# Altium project UPS.PrjPcb (part 2 of 3)

## Sheet Power.SchDoc: Power.SchDoc
size A4; Author: Daniel Sinko; Revision: A; SheetNumber: 3; SheetTotal: 5
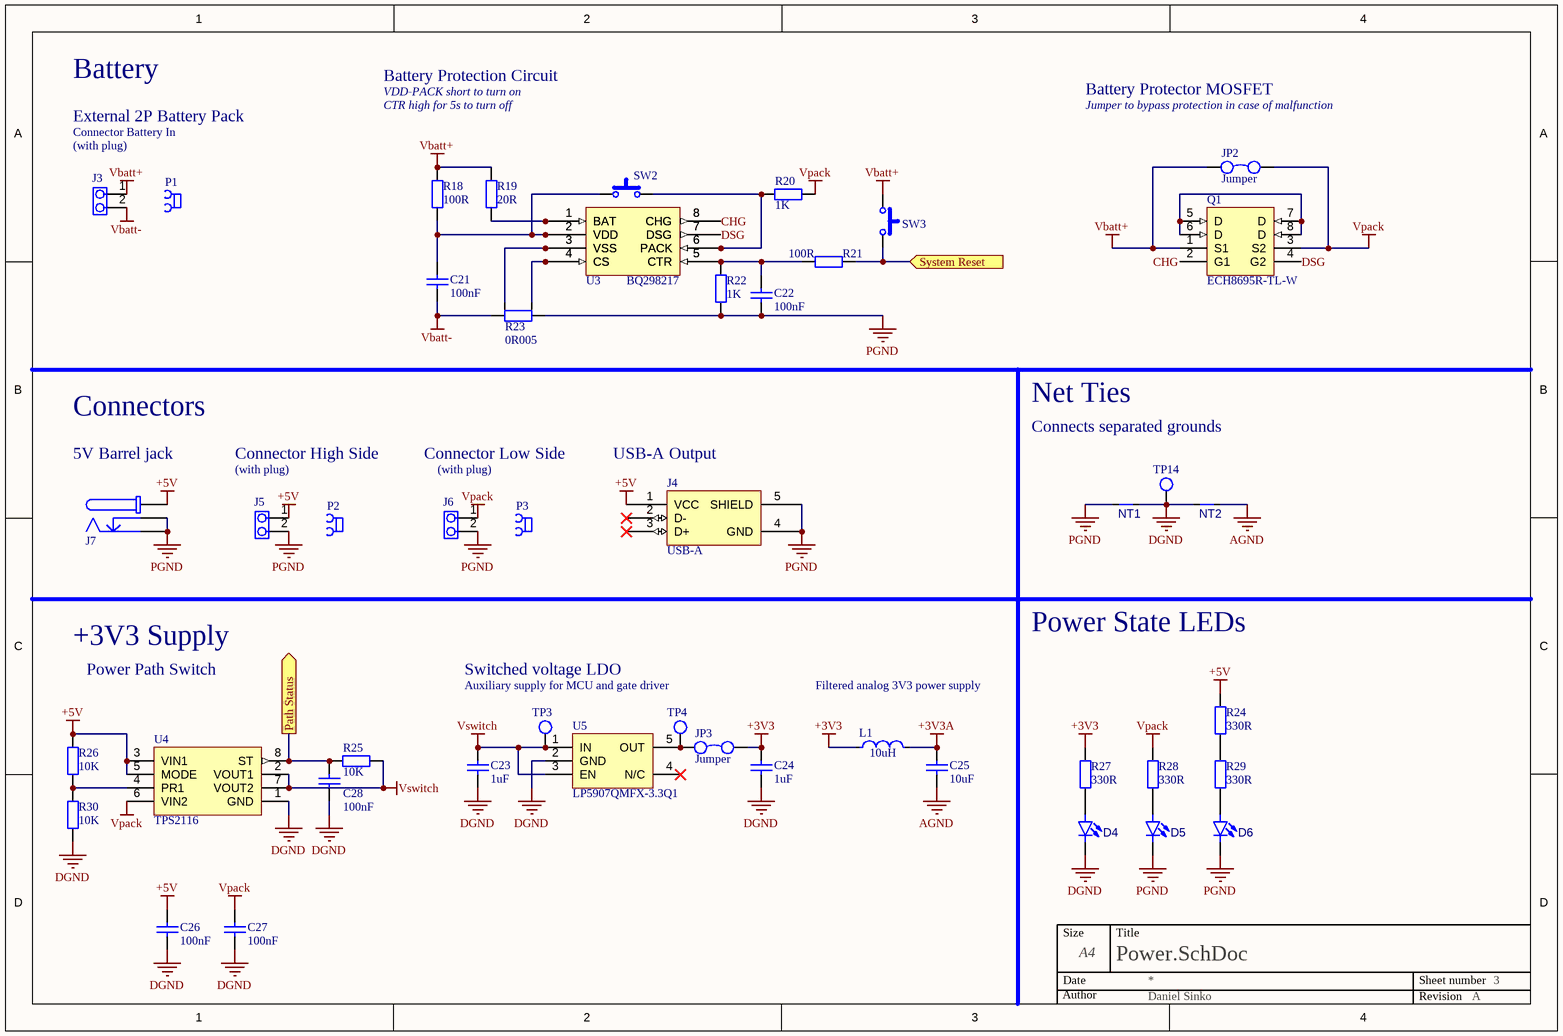
[diagram p3: Power.SchDoc]

### Parts
C21  100nF  [CAP0603]
C22  100nF  [CAP0603]
C23  1uF  [CAP0603]
C24  1uF  [CAP0603]
C25  10uF  [CAP0603]
C26  100nF  [CAP0603]
C27  100nF  [CAP0603]
C28  100nF  [CAP0603]
D4  (no value)  [LED0603]
D5  (no value)  [LED0603]
D6  (no value)  [LED0603]
J3  691313510002  [WR-TBL-5.08/2-M]  (value not drawn)
J4  USB-A  [USB-A-FEMALE]
J5  691313510002  [WR-TBL-5.08/2-M]  (value not drawn)
J6  691313510002  [WR-TBL-5.08/2-M]  (value not drawn)
J7  DC Power Jack  [DC Power Jack Right Angled]  (value not drawn)
JP2  Jumper  [PIN-1X2]
JP3  Jumper  [PIN-1X2]
L1  value 10uH  [IND0603]  (hidden comment: Inductor)
NT1  NetTie_1-1  [NETTIE_1.85MM]  (value not drawn)  (net tie, no BOM)
NT2  NetTie_1-1  [NETTIE_1.85MM]  (value not drawn)  (net tie, no BOM)
P1  691351500002  [WR-TBL-5.08/2-F]  (value not drawn)  (mechanical)
P2  691351500002  [WR-TBL-5.08/2-F]  (value not drawn)  (mechanical)
P3  691351500002  [WR-TBL-5.08/2-F]  (value not drawn)  (mechanical)
Q1  ECH8695R-TL-W  [SOT-28FL]
R18  100R  [RES0603]
R19  20R  [RES0603]
R20  1K  [RES0603]
R21  100R  [RES0603]
R22  1K  [RES0603]
R23  0R005  [RES1206_KELVIN]
R24  330R  [RES0603]
R25  10K  [RES0603]
R26  10K  [RES0603]
R27  330R  [RES0603]
R28  330R  [RES0603]
R29  330R  [RES0603]
R30  10K  [RES0603]
SW2  PTS526 Button  [PTS526 SMG15J SMTR2 LFS]  (value not drawn)
SW3  PTS526 Button  [PTS526 SMG15J SMTR2 LFS]  (value not drawn)
TP3  Test Point  [TP-1.5HOLE]  (value not drawn)
TP4  Test Point  [TP-1.5HOLE]  (value not drawn)
TP14  Test Point  [TP-1.5HOLE]  (value not drawn)
U3  BQ298217  [X2QFN-8]
U4  TPS2116  [SOTFL50P160X60-8N]
U5  LP5907QMFX-3.3Q1  [SOT23-5]

### Ports
Path Status (out, see Main[3C], uC[3B]), System Reset (in, see Main[3C], uC[3B])

### Nets
+3V3: C24.2 JP3.2 L1.1 R27.2
+3V3A: C25.2 L1.2
+5V: C26.2 J4.1(VCC) J5.1 J7.1 R24.2 R26.2 U4.3(VIN1) U4.5(MODE)
AGND: C25.1 NT2.2
DGND: C23.1 C24.1 C26.1 C27.1 C28.1 D4.1(K) NT1.2 NT2.1 R30.1 TP14.1 U4.1(GND) U5.2(GND)
PGND: C22.1 D5.1(K) D6.1(K) J4.4(GND) J4.5(SHIELD) J5.2 J6.2 J7.2 J7.3 NT1.1 R22.1 R23.2
Vbatt+: J3.1 JP2.1 Q1.1(S1) R18.2 R19.2 SW3.1
Vbatt-: C21.1 J3.2 R23.1
Vpack: C27.2 J6.1 JP2.2 Q1.3(S2) R20.2 R28.2 U4.6(VIN2)
Vswitch: C23.2 R25.1 TP3.1 U4.2(VOUT1) U4.7(VOUT2) U5.1(IN) U5.3(EN)
CHG: Q1.2(G1) U3.8(CHG)
DSG: Q1.4(G2) U3.7(DSG)
Path Status: C28.2 R25.2 U4.8(ST) ; port Path Status
System Reset: R21.2 SW3.2 ; port System Reset
NetC21_2: C21.2 R18.1 SW2.1 U3.2(VDD)
NetC22_2: C22.2 R21.1 R22.2 U3.5(CTR)
NetD4_2: D4.2(A) R27.1
NetD5_2: D5.2(A) R28.1
NetD6_2: D6.2(A) R29.1
NetJP3_1: JP3.1 TP4.1 U5.5(OUT)
NetQ1_5: Q1.5(D) Q1.6(D) Q1.7(D) Q1.8(D)
NetR19_1: R19.1 U3.1(BAT)
NetR20_1: R20.1 SW2.2 U3.6(PACK)
NetR23_3: R23.3 U3.3(VSS)
NetR23_4: R23.4 U3.4(CS)
NetR24_1: R24.1 R29.2
NetR26_1: R26.1 R30.2 U4.4(PR1)

Not connected (* = marked no-connect by the designer): J4 2(D-)* 3(D+)*; U5 4(N/C)*

### Notes on the sheet
- Battery
- Battery Protection Circuit
- VDD-PACK short to turn on
- CTR high for 5s to turn off
- Battery Protector MOSFET
- Jumper to bypass protection in case of malfunction
- External 2P Battery Pack
- Connector Battery In
- (with plug)
- Connectors
- Net Ties
- Connects separated grounds
- (near J7) 5V Barrel jack
- Connector High Side
- Connector Low Side
- (near J4) USB-A Output
- +3V3 Supply
- Power State LEDs
- Power Path Switch
- Switched voltage LDO
- Auxiliary supply for MCU and gate driver
- Filtered analog 3V3 power supply
- Size
- Date
- A4
- Title
- Sheet number
- Author
- Revision

### Library data of the parts
C21 C22 C26-C28 = 100nF: Ceramic Capacitor, Multilayer, Ceramic, 25V, 10% +Tol, 10% -Tol, X7R, 15% TC, 0.1uF, Surface Mount, 0603; Manufacturer: Samsung; Manufacturer Part Number: CL10B104KA8WPNC; Multilayer: Yes; Reference Standard: AEC-Q200; Voltage: *; Value: 100nF; Supplier: Mouser; Supplier Part Number: 187-CL10B104KA8WPNC; RoHS: Yes; Category: Ceramic Capacitors; Stock: 62899; Pricing: 1=0.1, 10=0.026, 50=0.026, 100=0.018, 1000=0.014, 10000=0.009 (USD); Mounting Technology: Surface Mount; Pins: 2; Dielectric Material: Ceramic; Package Shape: Rectangular; Case/Package: 0603; Terminal Finish: Nickel; Min Operating Temperature: -55°C; Max Operating Temperature: 125°C; JESD-609 Code: e3; Capacitor Type: Ceramic; Tolerance  (fill in as +-): 10%; Packaging: Tape and Reel; Tolerance (fill in as +-): 10%; Rated DC Voltage (URdc): 25V; Temperature Characteristics Code: X7R; Termination: Wraparound; Reach SVHC Compliant: Yes; RoHS Compliant: Yes; ComponentLink1URL: https://datasheet.ciiva.com:443/pdfs/VipMasterIC/IC/SEMS/SEMS-S-A0005596039/SEMS-S-A0005592818-1.pdf?src-supplier=IHS+Markit; ComponentLink1Description: https://datasheet.ciiva.com:443/pdfs/VipMasterIC/IC/SEMS/SEMS-S-A0005596039/SEMS-S-A0005592818-1.pdf?src-supplier=IHS+Markit; ComponentLink2URL: http://www.samsungsem.com/kr/support/library/product-catalog/mlcc.jsp?src-supplier=Digikey; ComponentLink2Description: http://www.samsungsem.com/kr/support/library/product-catalog/mlcc.jsp?src-supplier=Digikey; ComponentLink3URL: http://www.samsungsem.com/kr/support/product-search/mlcc/CL10B104KA8WPNC.jsp?src-supplier=Digikey; ComponentLink3Description: http://www.samsungsem.com/kr/support/product-search/mlcc/CL10B104KA8WPNC.jsp?src-supplier=Digikey; ComponentLink4URL: http://www.samsungsem.com/servlet/FileDownload?filename=productcatalog/pdf/MLCC.pdf&src-supplier=Avnet; ComponentLink4Description: http://www.samsungsem.com/servlet/FileDownload?filename=productcatalog/pdf/MLCC.pdf&src-supplier=Avnet; ComponentLink5URL: https://datasheet.octopart.com/CL10B104KA8WPNC-Samsung-Electro-Mechanics-datasheet-148763375.pdf?src-supplier=Future+Electronics; ComponentLink5Description: https://datasheet.octopart.com/CL10B104KA8WPNC-Samsung-Electro-Mechanics-datasheet-148763375.pdf?src-supplier=Future+Electronics; ComponentLink6URL: https://datasheet.octopart.com/CL10B104KA8WPNC-Samsung-datasheet-8326407.pdf?src-supplier=TME; ComponentLink6Description: https://datasheet.octopart.com/CL10B104KA8WPNC-Samsung-datasheet-8326407.pdf?src-supplier=TME
C23 C24 = 1uF: Ceramic Capacitor, Multilayer, Ceramic, 16V, 10% +Tol, 10% -Tol, X7R, 15% TC, 1uF, Surface Mount, 0603; Manufacturer: Walsin Technologies; Manufacturer Part Number: SH18B105K160CT; Voltage: *; Value: 1uF; Supplier: Mouser; Supplier Part Number: 791-SH18B105K160CT; RoHS: Yes; Category: Ceramic Capacitors; Stock: 5174; Pricing: 1=0.1, 10=0.04, 50=0.04, 100=0.023, 1000=0.015, 10000=0.01 (USD); ComponentLink1URL: https://datasheet.octopart.com/SH18B105K160CT-Walsin-Technologies-datasheet-149178370.pdf?src-supplier=TECHDesign; ComponentLink1Description: https://datasheet.octopart.com/SH18B105K160CT-Walsin-Technologies-datasheet-149178370.pdf?src-supplier=TECHDesign
C25 = 10uF: Ceramic Capacitor, Multilayer, Ceramic, 6.3V, 20% +Tol, 20% -Tol, X5R, 15% TC, 10uF, Surface Mount, 0603; Manufacturer: Samsung; Manufacturer Part Number: CL10A106MQ8NNND; Multilayer: Yes; Voltage: *; Supplier: Mouser; Supplier Part Number: 187-CL10A106MQ8NNND; RoHS: Yes; Category: Ceramic Capacitors; Stock: 103768; Pricing: 1=0.1, 10=0.066, 50=0.066, 100=0.031, 1000=0.019, 10000=0.014 (USD); Mounting Technology: Surface Mount; Pins: 2; Dielectric Material: Ceramic; Package Shape: Rectangular; Case/Package: 0603; Terminal Finish: Nickel; Min Operating Temperature: -55°C; Max Operating Temperature: 85°C; JESD-609 Code: e3; Capacitor Type: Ceramic; Tolerance  (fill in as +-): 20%; Package Style: SMTMeter; Packaging: Tape and Reel; Tolerance (fill in as +-): 20%; Rated DC Voltage (URdc): 6.3V; Temperature Characteristics Code: X5R; Termination: Wraparound; Length: 1.6mm; Width: 0.8mm; Height: 0.8mm; Reach SVHC Compliant: Yes; RoHS Compliant: Yes; ComponentLink1URL: https://datasheet.ciiva.com:443/pdfs/VipMasterIC/IC/SEMS/SEMS-S-A0008522793/SEMS-S-A0008522909-1.pdf?src-supplier=IHS+Markit; ComponentLink1Description: https://datasheet.ciiva.com:443/pdfs/VipMasterIC/IC/SEMS/SEMS-S-A0008522793/SEMS-S-A0008522909-1.pdf?src-supplier=IHS+Markit; Value: 10uF
D4-D6 = LED Green: Single Color LED, Bright Green, Water Clear, 1.1mm; Manufacturer: Wurth Electronics; Manufacturer Part Number: 150060VS75000; Shape: Rectangular; Forward Current: 30mA; Luminous Intensity-Nom: 40mcd; Channels: 1; Viewing Angle: 140°; Overall Height: 0.7mm; Supplier: Mouser; Supplier Part Number: 710-150060VS75000; RoHS: Yes; Category: LEDs; Stock: 96633; Pricing: 1=0.15, 10=0.15, 50=0.142, 100=0.122, 1000=0.116, 10000=0.116 (USD); Mounting Technology: Surface Mount; Pins: 2; Color: Green; Min Operating Temperature: -40°C; Max Operating Temperature: 85°C; Lens Style: WATER CLEAR; Optoelectronic Device Type: SINGLE COLOR LED; Packaging: Tape and Reel; Size: 1.1mm; Terminal Pitch: 1.6mm; Reach SVHC Compliant: Yes; RoHS Compliant: Yes; ComponentLink1URL: https://datasheet.ciiva.com:443/pdfs/VipMasterIC/IC/MIDC/MIDC-S-A0007768636/MIDC-S-A0007768636-1.pdf?src-supplier=IHS+Markit; ComponentLink1Description: https://datasheet.ciiva.com:443/pdfs/VipMasterIC/IC/MIDC/MIDC-S-A0007768636/MIDC-S-A0007768636-1.pdf?src-supplier=IHS+Markit; ComponentLink2URL: https://datasheet.ciiva.com/29562/150060vs75000-29562919.pdf?src-supplier=Digikey; ComponentLink2Description: https://datasheet.ciiva.com/29562/150060vs75000-29562919.pdf?src-supplier=Digikey
J3 J5 J6 = 691313510002: Wurth Elektronik, 2 Pin Pluggable Terminal Block, Male; Manufacturer: Wurth Electronics; Manufacturer Series: 313; Fastening Method: CONNECTOR; Number of Decks: 1; Number of Ways: 2; Current Rating: 20A; Voltage Rating: 300V; Safety Approval: UL,VDE; Datasheet Link: https://www.we-online.de/katalog/datasheet/6913135100xx.pdf; Height: 8.5mm; Manufacturer_Name: Wurth Elektronik; Manufacturer_Part_Number: 691313510002; Mouser Part Number: 710-691313510002; Mouser Price/Stock: https://www.mouser.co.uk/ProductDetail/Wurth-Elektronik/691313510002?qs=2kOmHSv6VfR6BrMDgUh3kQ%3D%3D; Supplier: Mouser; Supplier Part Number: 710-691313510002; Manufacturer Part Number: 691313510002; RoHS: Yes; Category: Terminal Blocks; Stock: 1885; Pricing: 1=0.35, 10=0.315, 50=0.295, 100=0.295, 1000=0.295, 10000=0.294 (USD); Mounting Technology: Board; Number of Rows: 1; Terminal and Terminal Block Type: STRIP TERMINAL BLOCK; Reach SVHC Compliant: Yes; RoHS Compliant: Yes; ComponentLink1URL: https://datasheet.ciiva.com:443/pdfs/VipMasterIC/IC/MIDC/MIDC-S-A0008053020/MIDC-S-A0008053020-1.pdf?src-supplier=IHS+Markit; ComponentLink1Description: https://datasheet.ciiva.com:443/pdfs/VipMasterIC/IC/MIDC/MIDC-S-A0008053020/MIDC-S-A0008053020-1.pdf?src-supplier=IHS+Markit; ComponentLink2URL: https://datasheet.ciiva.com/8043/1442232-8043521.pdf?src-supplier=Element14; ComponentLink2Description: https://datasheet.ciiva.com/8043/1442232-8043521.pdf?src-supplier=Element14; ComponentLink3URL: https://datasheet.ciiva.com/795/6913135100xx-795821.pdf?src-supplier=Digikey; ComponentLink3Description: https://datasheet.ciiva.com/795/6913135100xx-795821.pdf?src-supplier=Digikey
J4 = USB-A: USB Connector; Manufacturer: Bel; Manufacturer Part Number: SS-52100-001; Supplier: Mouser; Supplier Part Number: 530-SS-52100-001; RoHS: Yes; Category: Connectors; Stock: 6440; Pricing: 1=0.57, 10=0.346, 50=0.346, 100=0.286, 1000=0.252, 10000=0.252 (USD); RoHS Compliant: Yes; ComponentLink1URL: https://datasheet.ciiva.com:443/pdfs/VipMasterIC/IC/BELF/BELF-S-A0007110717/BELF-S-A0007110717-1.pdf?src-supplier=IHS+Markit; ComponentLink1Description: https://datasheet.ciiva.com:443/pdfs/VipMasterIC/IC/BELF/BELF-S-A0007110717/BELF-S-A0007110717-1.pdf?src-supplier=IHS+Markit; ComponentLink2URL: http://www.farnell.com/datasheets/2813579.pdf?src-supplier=Farnell; ComponentLink2Description: http://www.farnell.com/datasheets/2813579.pdf?src-supplier=Farnell; ComponentLink3URL: https://belfuse.com/resources/drawings/stewartconnector/dr-stw-ss-52100-001.pdf?src-supplier=Digikey; ComponentLink3Description: https://belfuse.com/resources/drawings/stewartconnector/dr-stw-ss-52100-001.pdf?src-supplier=Digikey; ComponentLink4URL: http://www.farnell.com/datasheets/2813579.pdf?src-supplier=Newark; ComponentLink4Description: http://www.farnell.com/datasheets/2813579.pdf?src-supplier=Newark; ComponentLink5URL: https://datasheet.octopart.com/SS-52100-001-Bel-Fuse-datasheet-137355466.pdf?src-supplier=Sager+Electronics; ComponentLink5Description: https://datasheet.octopart.com/SS-52100-001-Bel-Fuse-datasheet-137355466.pdf?src-supplier=Sager+Electronics
J7 = DC Power Jack: CIRCULAR DC POWER CONNECTOR; Manufacturer: Wurth Electronics; Manufacturer Part Number: 694106301002; Connector Type: Circular,Power; Supplier: Mouser; Supplier Part Number: 710-694106301002; RoHS: Yes; Category: Power Connectors; Stock: 9038; Contact Finish - Mating: NOT SPECIFIED; Reach SVHC Compliant: Yes; RoHS Compliant: Yes; ComponentLink1URL: https://datasheet.ciiva.com:443/pdfs/VipMasterIC/IC/MIDC/MIDC-S-A0001192814/MIDC-S-A0001192814-1.pdf?src-supplier=IHS+Markit; ComponentLink1Description: https://datasheet.ciiva.com:443/pdfs/VipMasterIC/IC/MIDC/MIDC-S-A0001192814/MIDC-S-A0001192814-1.pdf?src-supplier=IHS+Markit; ComponentLink2URL: http://www.mouser.com/ds/2/445/6941xx301002-469315.pdf?src-supplier=Mouser; ComponentLink2Description: http://www.mouser.com/ds/2/445/6941xx301002-469315.pdf?src-supplier=Mouser; ComponentLink3URL: http://www.farnell.com/cad/2130967.pdf?src-supplier=Element14; ComponentLink3Description: http://www.farnell.com/cad/2130967.pdf?src-supplier=Element14; ComponentLink4URL: https://katalog.we-online.de/em/datasheet/6941xx301002.pdf?src-supplier=Digikey; ComponentLink4Description: https://katalog.we-online.de/em/datasheet/6941xx301002.pdf?src-supplier=Digikey; Pricing: 1=1.02, 10=0.97, 50=0.86, 100=0.8, 1000=0.59, 10000=0.59 (USD)
JP2 JP3 = Jumper: Interconnection Device; Manufacturer: Harwin; Manufacturer Part Number: M7582-46; Manufacturer Series: M75; Additional Feature: ROHS COMPLIANT; Body/Shell Style: PLUG; Contact Pattern: RECTANGULAR; Contact Resistance: 20mR; Contact Style: SQ PIN-SKT; Dielectric Withstanding Voltage (AC): 500V; Insertion Force-Max: 6.672N; Insulation Resistance: 5GR; Number Of Connectors: 1; Rated Current (Signal): 1A; Number of Contacts: 2; Body Breadth: 0.094inch; Body Depth: 0.236inch; Body Length: 0.197inch; Mating Contact Pitch: 0.1inch; Reference Standard: UL; Reliability: COMMERCIAL; Supplier: Mouser; Supplier Part Number: 855-M7582-46; RoHS: Yes; Category: Uncategorized; Stock: 4991; Pricing: 1=0.19, 10=0.125, 50=0.125, 100=0.104, 1000=0.075, 10000=0.072 (USD); Contact Material: Bronze; Contact Finish - Mating: SN; Contact Finish - Termination: Tin (Sn); Insulation Color: Black; Insulation Material: Glass; Min Operating Temperature: -55°C; Max Operating Temperature: 105°C; Connector Type: Interconnection Device; JESD-609 Code: e3; Contact Gender: Female; Mounting Style: STRAIGHT; Number of Rows Loaded: 1; Reach SVHC Compliant: Yes; RoHS Compliant: Yes; ComponentLink1URL: https://datasheet.ciiva.com:443/pdfs/VipMasterIC/IC/HRWN/HRWNS06295/HRWNS06295-1.pdf?src-supplier=IHS+Markit; ComponentLink1Description: https://datasheet.ciiva.com:443/pdfs/VipMasterIC/IC/HRWN/HRWNS06295/HRWNS06295-1.pdf?src-supplier=IHS+Markit; ComponentLink2URL: http://www.mouser.com/ds/2/181/M7580-M7583-351524.pdf?src-supplier=Mouser; ComponentLink2Description: http://www.mouser.com/ds/2/181/M7580-M7583-351524.pdf?src-supplier=Mouser; ComponentLink3URL: https://cdn.harwin.com/pdfs/Harwin_PC_Connectors_M20.pdf?src-supplier=Digikey; ComponentLink3Description: https://cdn.harwin.com/pdfs/Harwin_PC_Connectors_M20.pdf?src-supplier=Digikey; ComponentLink4URL: http://www.harwin.com/include/downloads/pdfs/2010PAGE125.PDF?src-supplier=Avnet; ComponentLink4Description: http://www.harwin.com/include/downloads/pdfs/2010PAGE125.PDF?src-supplier=Avnet
L1 = 10uH: General Purpose Inductor, 10uH, 20%, 1 Element, Ferrite-Core, SMD, 1608M; Manufacturer: TDK; Manufacturer Part Number: MLZ1608E100MT; Manufacturer Series: MLZ; Case/Size Code: 1608-M; DC Resistance (DCR): 900mR; Inductor Application: POWER INDUCTOR; Channels: 1; Max Current Rating: 250mA; Self Resonant Frequency: 50MHz; Shape/Size Description: RECTANGULAR PACKAGE; Shielding: Shielded; Test Frequency: 2MHz; Package Height: 0.8mm; Package Length: 1.6mm; Supplier: Mouser; Supplier Part Number: 810-MLZ1608E100MT; RoHS: Yes; Category: Fixed Inductors; Stock: 135059; Pricing: 1=0.1, 10=0.092, 50=0.092, 100=0.065, 1000=0.045, 10000=0.038 (USD); Pins: 2; Min Operating Temperature: -55°C; Max Operating Temperature: 125°C; Tolerance: 20%; Inductance-Nom (L): 10uH; Inductor Type: GENERAL PURPOSE INDUCTOR; Surface Mount: Yes; Terminal Placement: Dual Ended; Termination: Wraparound; Reach SVHC Compliant: Yes; RoHS Compliant: Yes; ComponentLink1URL: https://datasheet.ciiva.com:443/pdfs/VipMasterIC/IC/TDKC/TDKCS08829/TDKCS08829-1.pdf?src-supplier=IHS+Markit; ComponentLink1Description: https://datasheet.ciiva.com:443/pdfs/VipMasterIC/IC/TDKC/TDKCS08829/TDKCS08829-1.pdf?src-supplier=IHS+Markit; Core Material: Ferrite; Construction: Magnetic Shielded; Package Style: SMTMeter; Packaging: Tape and Reel; Series: MLZ1608; Package Width: 0.8mm; ComponentLink2URL: https://datasheet.ciiva.com/11802/0900766b8082f86a-11802168.pdf?src-supplier=Rs; ComponentLink2Description: https://datasheet.ciiva.com/11802/0900766b8082f86a-11802168.pdf?src-supplier=Rs; ComponentLink3URL: https://datasheet.ciiva.com/4963/inductor-commercial-decoupling-mlz-en-310280-4963660.pdf?src-supplier=Mouser; ComponentLink3Description: https://datasheet.ciiva.com/4963/inductor-commercial-decoupling-mlz-en-310280-4963660.pdf?src-supplier=Mouser
NT1 NT2 = NetTie_1-1: NetTie 1 -> 1; ID: 22; Value: NetTie 1-1 0.2mm; Inventory_Category: Other; Part Class: NetTie; Technology: SMT
P1-P3 = 691351500002: Wurth Elektronik, 2 Pin Pluggable Terminal Block, Female; Manufacturer: Wurth Electronics; Manufacturer Series: 3515; ComponentLink1URL: https://datasheet.ciiva.com:443/pdfs/VipMasterIC/IC/MIDC/MIDC-S-A0008053020/MIDC-S-A0008053020-1.pdf?src-supplier=IHS+Markit; ComponentLink1Description: https://datasheet.ciiva.com:443/pdfs/VipMasterIC/IC/MIDC/MIDC-S-A0008053020/MIDC-S-A0008053020-1.pdf?src-supplier=IHS+Markit; ComponentLink2URL: https://datasheet.ciiva.com/8043/1442232-8043521.pdf?src-supplier=Element14; ComponentLink2Description: https://datasheet.ciiva.com/8043/1442232-8043521.pdf?src-supplier=Element14; ComponentLink3URL: https://datasheet.ciiva.com/795/6913135100xx-795821.pdf?src-supplier=Digikey; ComponentLink3Description: https://datasheet.ciiva.com/795/6913135100xx-795821.pdf?src-supplier=Digikey; Supplier: Mouser; Supplier Part Number: 710-691351500002; Manufacturer Part Number: 691351500002; RoHS: Yes; Category: Terminal Blocks; Stock: 2108; Pricing: 1=1.03, 10=0.919, 50=0.87, 100=0.87, 1000=0.87, 10000=0.87 (USD); Terminal and Terminal Block Type: BARRIER STRIP TERMINAL BLOCK; Reach SVHC Compliant: No; RoHS Compliant: Yes; ComponentLink4URL: https://datasheet.ciiva.com:443/pdfs/VipMasterIC/IC/MIDC/MIDCS16685/MIDCS16685-1.pdf?src-supplier=IHS+Markit; ComponentLink4Description: https://datasheet.ciiva.com:443/pdfs/VipMasterIC/IC/MIDC/MIDCS16685/MIDCS16685-1.pdf?src-supplier=IHS+Markit; ComponentLink5URL: https://datasheet.ciiva.com/7992/624595-7992355.pdf?src-supplier=Element14; ComponentLink5Description: https://datasheet.ciiva.com/7992/624595-7992355.pdf?src-supplier=Element14; ComponentLink6URL: https://datasheet.ciiva.com/796/6913515000xx-796118.pdf?src-supplier=Digikey; ComponentLink6Description: https://datasheet.ciiva.com/796/6913515000xx-796118.pdf?src-supplier=Digikey; ComponentLink7URL: https://datasheet.ciiva.com/48686/001088727-da-01-en-wr-tbl-terminal-block351-691351500002-48686810.pdf?src-supplier=Conrad; ComponentLink7Description: https://datasheet.ciiva.com/48686/001088727-da-01-en-wr-tbl-terminal-block351-691351500002-48686810.pdf?src-supplier=Conrad
Q1 = ECH8695R-TL-W: Power Field-Effect Transistor, 11A I(D), N-Channel, Metal-oxide Semiconductor FET; Manufacturer_Name: onsemi; Manufacturer: ON Semiconductor; Power Dissipation-Max (Abs): 1.5W; Datasheet Link: https://datasheet.datasheetarchive.com/originals/distributors/DKDS-17/338047.pdf; Height: 0.95mm; Manufacturer_Part_Number: ECH8695R-TL-W; Mouser Part Number: 863-ECH8695R-TL-W; Mouser Price/Stock: https://www.mouser.co.uk/ProductDetail/ON-Semiconductor/ECH8695R-TL-W?qs=dbuNSGnowt2koJiK%2FkW5Eg%3D%3D; Arrow Part Number: ECH8695R-TL-W; Arrow Price/Stock: https://www.arrow.com/en/products/ech8695r-tl-w/on-semiconductor?region=europe; Supplier: Mouser; Supplier Part Number: 863-ECH8695R-TL-W; Manufacturer Part Number: ECH8695R-TL-W; RoHS: Yes; Category: MOSFETs; Stock: 28139; Pricing: 1=0.62, 10=0.473, 50=0.473, 100=0.364, 1000=0.295, 10000=0.246 (USD); Terminal Finish: Tin; Max Operating Temperature: 150°C; JESD-609 Code: e6; Polarity/Channel Type: N-CHANNEL; Drain Current-Max (Abs) (ID): 11A; FET Technology: METAL-OXIDE SEMICONDUCTOR; Moisture Sensitivity Level: 1; Surface Mount: Yes; RoHS Compliant: Yes; Reach SVHC Compliant: No; ComponentLink1URL: https://datasheet.ciiva.com:443/pdfs/VipMasterIC/IC/ONSM/ONSM-S-A0002809098/ONSM-S-A0002809098-1.pdf?src-supplier=IHS+Markit; ComponentLink1Description: https://datasheet.ciiva.com:443/pdfs/VipMasterIC/IC/ONSM/ONSM-S-A0002809098/ONSM-S-A0002809098-1.pdf?src-supplier=IHS+Markit; ComponentLink2URL: http://www.mouser.com/ds/2/308/ENA2314-D-466764.pdf?src-supplier=Mouser; ComponentLink2Description: http://www.mouser.com/ds/2/308/ENA2314-D-466764.pdf?src-supplier=Mouser; ComponentLink3URL: http://uk.rs-online.com/webdocs/1366/0900766b81366e5e.pdf?src-supplier=Rs; ComponentLink3Description: http://uk.rs-online.com/webdocs/1366/0900766b81366e5e.pdf?src-supplier=Rs; ComponentLink4URL: http://www.alliedelec.com/m/d/7426d35da80661b4f4a350039c44cd95.pdf?src-supplier=Allied+Electronics; ComponentLink4Description: http://www.alliedelec.com/m/d/7426d35da80661b4f4a350039c44cd95.pdf?src-supplier=Allied+Electronics; ComponentLink5URL: http://www.onsemi.com/pub/Collateral/ECH8695R-D.PDF?src-supplier=Digikey; ComponentLink5Description: http://www.onsemi.com/pub/Collateral/ECH8695R-D.PDF?src-supplier=Digikey; ComponentLink6URL: http://www.onsemi.com/pub/Collateral/ENA2314-D.PDF?src-supplier=Avnet; ComponentLink6Description: http://www.onsemi.com/pub/Collateral/ENA2314-D.PDF?src-supplier=Avnet
R18 R21 = 100R: Fixed Resistor, Metal Glaze/thick Film, 0.1W, 100ohm, 75V, 5% +/-Tol, 100ppm/Cel, Surface Mount, 0603; Manufacturer: Yageo; Manufacturer Part Number: RC0603JR-13100RL; Additional Feature: LASER TRIMMABLE; Rated Temperature: 70°C; Temperature Coefficient: 100ppm/°C; Package Height: 0.45mm; Package Length: 1.6mm; Package Width: 0.8mm; Value: 100R; Supplier Part Number: 603-RC0603JR-13100RL; RoHS: Yes; Category: Chip SMD Resistors; Stock: 92782; Pricing: 1=0.1, 10=0.01, 50=0.01, 100=0.006, 1000=0.005, 10000=0.003 (USD); Mounting Technology: Surface Mount; Pins: 2; Package Shape: Rectangular; Case/Package: 0603; Terminal Finish: Nickel; Min Operating Temperature: -55°C; Max Operating Temperature: 155°C; JESD-609 Code: e3; Resistor Type: FIXED RESISTOR; Construction: Chip; Packaging: Tape and Reel; Technology: METAL GLAZE/THICK FILM; Termination: Wraparound; Working Voltage: 75V; Reach SVHC Compliant: Yes; RoHS Compliant: Yes; ComponentLink1URL: https://datasheet.ciiva.com:443/pdfs/VipMasterIC/IC/YAGO/YAGO-S-A0008145938/YAGO-S-A0008145938-1.pdf?src-supplier=IHS+Markit; ComponentLink1Description: https://datasheet.ciiva.com:443/pdfs/VipMasterIC/IC/YAGO/YAGO-S-A0008145938/YAGO-S-A0008145938-1.pdf?src-supplier=IHS+Markit; ComponentLink2URL: https://datasheet.ciiva.com/12558/rc0603-272842-12558903.pdf?src-supplier=Mouser; ComponentLink2Description: https://datasheet.ciiva.com/12558/rc0603-272842-12558903.pdf?src-supplier=Mouser; ComponentLink3URL: https://datasheet.ciiva.com/7983/443971-7983750.pdf?src-supplier=Element14; ComponentLink3Description: https://datasheet.ciiva.com/7983/443971-7983750.pdf?src-supplier=Element14
R19 = 20R: Fixed Resistor, Metal Glaze/thick Film, 0.1W, 20ohm, 75V, 1% +/-Tol, 100ppm/Cel, Surface Mount, 0603; Manufacturer: Vishay; Manufacturer Part Number: CRCW060320R0FKEA; Temperature Coefficient: 100ppm/°C; Rated Temperature: 70°C; Package Height: 0.45mm; Package Length: 1.55mm; Package Width: 0.85mm; Reference Standard: AEC-Q200; Value: 20R; Supplier Part Number: 71-CRCW0603-20-E3; RoHS: Yes; Category: Chip SMD Resistors; Stock: 239322; Pricing: 1=0.1, 10=0.014, 50=0.014, 100=0.01, 1000=0.008, 10000=0.004 (USD); Mounting Technology: Surface Mount; Pins: 2; Case/Package: 0603; Terminal Finish: Nickel; Package Shape: Rectangular; Min Operating Temperature: -55°C; Max Operating Temperature: 155°C; JESD-609 Code: e3; Resistor Type: FIXED RESISTOR; Construction: Chip; Packaging: Tape and Reel; Technology: METAL GLAZE/THICK FILM; Working Voltage: 75V; Termination: Wraparound; Reach SVHC Compliant: Yes; RoHS Compliant: Yes; ComponentLink1URL: https://datasheet.ciiva.com:443/pdfs/VipMasterIC/IC/VISH/VISH-S-A0007266705/VISH-S-A0007266705-1.pdf?src-supplier=IHS+Markit; ComponentLink1Description: https://datasheet.ciiva.com:443/pdfs/VipMasterIC/IC/VISH/VISH-S-A0007266705/VISH-S-A0007266705-1.pdf?src-supplier=IHS+Markit; ComponentLink2URL: https://datasheet.ciiva.com/11810/0900766b80d98afc-11810778.pdf?src-supplier=Rs; ComponentLink2Description: https://datasheet.ciiva.com/11810/0900766b80d98afc-11810778.pdf?src-supplier=Rs; ComponentLink3URL: https://datasheet.ciiva.com/26316/fld-crcw-e3-data-en-26316589.pdf?src-supplier=Distrelec; ComponentLink3Description: https://datasheet.ciiva.com/26316/fld-crcw-e3-data-en-26316589.pdf?src-supplier=Distrelec; ComponentLink4URL: https://datasheet.ciiva.com/16776/70201119-16776202.pdf?src-supplier=Allied+Electronics; ComponentLink4Description: https://datasheet.ciiva.com/16776/70201119-16776202.pdf?src-supplier=Allied+Electronics; ComponentLink5URL: https://datasheet.ciiva.com/16788/70201119-16788011.pdf?src-supplier=Allied+Electronics; ComponentLink5Description: https://datasheet.ciiva.com/16788/70201119-16788011.pdf?src-supplier=Allied+Electronics; ComponentLink6URL: https://datasheet.ciiva.com/3257/dcrcwe3-3257244.pdf?src-supplier=Avnet; ComponentLink6Description: https://datasheet.ciiva.com/3257/dcrcwe3-3257244.pdf?src-supplier=Avnet; ComponentLink7URL: https://datasheet.ciiva.com/16374/dcrcwe3-16374634.pdf?src-supplier=Future+Electronics; ComponentLink7Description: https://datasheet.ciiva.com/16374/dcrcwe3-16374634.pdf?src-supplier=Future+Electronics; ComponentLink8URL: https://datasheet.ciiva.com/7748/1533075-7748858.pdf?src-supplier=Element14; ComponentLink8Description: https://datasheet.ciiva.com/7748/1533075-7748858.pdf?src-supplier=Element14; ComponentLink9URL: https://datasheet.ciiva.com/2465/dcrcwe3-2465673.pdf?src-supplier=Digikey; ComponentLink9Description: https://datasheet.ciiva.com/2465/dcrcwe3-2465673.pdf?src-supplier=Digikey; ComponentLink10URL: https://datasheet.ciiva.com/2465/dcrcwe3-2465674.pdf?src-supplier=Digikey; ComponentLink10Description: https://datasheet.ciiva.com/2465/dcrcwe3-2465674.pdf?src-supplier=Digikey; ComponentLink11URL: https://datasheet.ciiva.com/2465/dcrcwe3-2465672.pdf?src-supplier=Digikey; ComponentLink11Description: https://datasheet.ciiva.com/2465/dcrcwe3-2465672.pdf?src-supplier=Digikey; ComponentLink12URL: https://datasheet.ciiva.com/5548/dcrcwe3-109170-5548022.pdf?src-supplier=Mouser; ComponentLink12Description: https://datasheet.ciiva.com/5548/dcrcwe3-109170-5548022.pdf?src-supplier=Mouser; ComponentLink13URL: https://datasheet.ciiva.com/3257/dcrcwe3-3257243.pdf?src-supplier=Avnet; ComponentLink13Description: https://datasheet.ciiva.com/3257/dcrcwe3-3257243.pdf?src-supplier=Avnet
R20 R22 = 1K: Fixed Resistor, Metal Glaze/thick Film, 0.1W, 1000ohm, 75V, 1% +/-Tol, 100ppm/Cel, Surface Mount, 0603; Manufacturer: Bourns; Manufacturer Part Number: CR0603-FX-1001ELF; Rated Temperature: 70°C; Temperature Coefficient: 100ppm/°C; Working Voltage: 50V; Package Height: 0.45mm; Package Length: 1.6mm; Package Width: 0.8mm; Value: 1K; Supplier Part Number: 652-CR0603FX-1001ELF; RoHS: Yes; Category: Chip SMD Resistors; Stock: 320220; Pricing: 1=0.1, 10=0.009, 50=0.009, 100=0.005, 1000=0.004, 10000=0.002 (USD); Mounting Technology: Surface Mount; Pins: 2; Package Shape: Rectangular; Case/Package: 0603; Terminal Finish: Nickel; Min Operating Temperature: -55°C; Max Operating Temperature: 155°C; JESD-609 Code: e3; Termination: Wraparound; Resistor Type: FIXED RESISTOR; Construction: Chip; Packaging: Tape and Reel; Technology: RUTHENIUM OXIDE; Reach SVHC Compliant: Yes; RoHS Compliant: Yes; ComponentLink1URL: https://datasheet.ciiva.com:443/pdfs/VipMasterIC/IC/BOUR/BOUR-S-A0009069624/BOUR-S-A0009069624-1.pdf?src-supplier=IHS+Markit; ComponentLink1Description: https://datasheet.ciiva.com:443/pdfs/VipMasterIC/IC/BOUR/BOUR-S-A0009069624/BOUR-S-A0009069624-1.pdf?src-supplier=IHS+Markit; ComponentLink2URL: https://datasheet.ciiva.com/11808/0900766b80fcdb72-11808035.pdf?src-supplier=Rs; ComponentLink2Description: https://datasheet.ciiva.com/11808/0900766b80fcdb72-11808035.pdf?src-supplier=Rs; ComponentLink3URL: https://datasheet.ciiva.com/19466/774882-19466523.pdf?src-supplier=Jameco; ComponentLink3Description: https://datasheet.ciiva.com/19466/774882-19466523.pdf?src-supplier=Jameco; ComponentLink4URL: https://datasheet.ciiva.com/7001/1902866-7001622.pdf?src-supplier=Newark; ComponentLink4Description: https://datasheet.ciiva.com/7001/1902866-7001622.pdf?src-supplier=Newark; ComponentLink5URL: https://datasheet.ciiva.com/7986/691949-7986156.pdf?src-supplier=Element14; ComponentLink5Description: https://datasheet.ciiva.com/7986/691949-7986156.pdf?src-supplier=Element14; ComponentLink6URL: https://datasheet.ciiva.com/22693/1902866-22693205.pdf?src-supplier=Element14; ComponentLink6Description: https://datasheet.ciiva.com/22693/1902866-22693205.pdf?src-supplier=Element14; ComponentLink7URL: https://datasheet.ciiva.com/5546/chpreztr-5546283.pdf?src-supplier=Mouser; ComponentLink7Description: https://datasheet.ciiva.com/5546/chpreztr-5546283.pdf?src-supplier=Mouser; ComponentLink8URL: https://datasheet.ciiva.com/16757/70154685-16757482.pdf?src-supplier=Allied+Electronics; ComponentLink8Description: https://datasheet.ciiva.com/16757/70154685-16757482.pdf?src-supplier=Allied+Electronics; ComponentLink9URL: https://datasheet.ciiva.com/3255/chpreztr-3255917.pdf?src-supplier=Avnet; ComponentLink9Description: https://datasheet.ciiva.com/3255/chpreztr-3255917.pdf?src-supplier=Avnet; ComponentLink10URL: https://datasheet.ciiva.com/6547/chpreztr-6547350.pdf?src-supplier=Digikey; ComponentLink10Description: https://datasheet.ciiva.com/6547/chpreztr-6547350.pdf?src-supplier=Digikey; ComponentLink11URL: https://datasheet.ciiva.com/6547/chpreztr-6547351.pdf?src-supplier=Digikey; ComponentLink11Description: https://datasheet.ciiva.com/6547/chpreztr-6547351.pdf?src-supplier=Digikey; ComponentLink12URL: https://datasheet.ciiva.com/6547/chpreztr-6547349.pdf?src-supplier=Digikey; ComponentLink12Description: https://datasheet.ciiva.com/6547/chpreztr-6547349.pdf?src-supplier=Digikey; ComponentLink13URL: https://datasheet.ciiva.com/30115/159chpreztr-30115222.pdf?src-supplier=Onlinecomponents.com; ComponentLink13Description: https://datasheet.ciiva.com/30115/159chpreztr-30115222.pdf?src-supplier=Onlinecomponents.com
R23 = 0R005: Resistor Current Sense Metal Foil 1206 5m Ohm 1% 1W ±50ppm/°C T/R; Manufacturer: Eaton; Manufacturer Part Number: MFSA1206R0050FCM; Supplier Part Number: 504-MFSA1206R0050FCM; RoHS: No; Category: Chip SMD Resistors; Stock: 9199; Pricing: 1=0.21, 10=0.173, 50=0.173, 100=0.128, 1000=0.096, 10000=0.062 (USD); Temperature Coefficient: 50ppm/°C; Value: 0R005
R24 R27-R29 = 330R: Fixed Resistor, Metal Glaze/thick Film, 0.1W, 330ohm, 75V, 1% +/-Tol, 100ppm/Cel, Surface Mount, 0603; Manufacturer: Walsin Technologies; Manufacturer Part Number: WR06X3300FTL; Rated Temperature: 70°C; Temperature Coefficient: 100ppm/°C; Working Voltage: 50V; Package Height: 0.45mm; Package Length: 1.6mm; Package Width: 0.8mm; Value: 330R; Supplier Part Number: 791-WR06X3300FTL; RoHS: Yes; Category: Chip SMD Resistors; Stock: 10415; Pricing: 1=0.1, 10=0.007, 50=0.007, 100=0.003, 1000=0.003, 10000=0.001 (USD); Mounting Technology: Surface Mount; Pins: 2; Package Shape: Rectangular; Case/Package: 0603; Terminal Finish: Nickel; Min Operating Temperature: -55°C; Max Operating Temperature: 155°C; JESD-609 Code: e3; Resistor Type: FIXED RESISTOR; Packaging: Tape and Reel; Termination: Wraparound; Construction: Chip; Technology: METAL GLAZE/THICK FILM; Reach SVHC Compliant: Yes; RoHS Compliant: Yes; ComponentLink1URL: https://datasheet.ciiva.com:443/pdfs/VipMasterIC/IC/WATC/WATC-S-A0005256878/WATC-S-A0005256878-1.pdf?src-supplier=IHS+Markit; ComponentLink1Description: https://datasheet.ciiva.com:443/pdfs/VipMasterIC/IC/WATC/WATC-S-A0005256878/WATC-S-A0005256878-1.pdf?src-supplier=IHS+Markit; ComponentLink2URL: http://www.farnell.com/datasheets/1960319.pdf?src-supplier=Farnell; ComponentLink2Description: http://www.farnell.com/datasheets/1960319.pdf?src-supplier=Farnell; ComponentLink3URL: https://datasheet.octopart.com/WR06X3300FTL-Walsin-Technologies-datasheet-48038251.pdf?src-supplier=Element14; ComponentLink3Description: https://datasheet.octopart.com/WR06X3300FTL-Walsin-Technologies-datasheet-48038251.pdf?src-supplier=Element14; ComponentLink4URL: https://www.verical.com/server-webapp/html/getDatasheet?partID=414704&src-supplier=Verical; ComponentLink4Description: https://www.verical.com/server-webapp/html/getDatasheet?partID=414704&src-supplier=Verical
R25 R26 R30 = 10K: Fixed Resistor, Metal Glaze/thick Film, 0.1W, 10000ohm, 75V, 1% +/-Tol, 100ppm/Cel, Surface Mount, 0603; Manufacturer: Bourns; Manufacturer Part Number: CR0603-FX-1002ELF; Rated Temperature: 70°C; Temperature Coefficient: 100ppm/°C; Working Voltage: 50V; Package Height: 0.45mm; Package Length: 1.6mm; Package Width: 0.8mm; Value: 10K; Supplier Part Number: 652-CR0603FX-1002ELF; RoHS: Yes; Category: Chip SMD Resistors; Stock: 335503; Pricing: 1=0.1, 10=0.009, 50=0.009, 100=0.005, 1000=0.004, 10000=0.002 (USD); Mounting Technology: Surface Mount; Pins: 2; Package Shape: Rectangular; Case/Package: 0603; Terminal Finish: Nickel; Min Operating Temperature: -55°C; Max Operating Temperature: 155°C; Termination: Wraparound; JESD-609 Code: e3; Resistor Type: FIXED RESISTOR; Construction: Chip; Packaging: Tape and Reel; Technology: RUTHENIUM OXIDE; Reach SVHC Compliant: Yes; RoHS Compliant: Yes; ComponentLink1URL: https://datasheet.ciiva.com:443/pdfs/VipMasterIC/IC/BOUR/BOUR-S-A0009069624/BOUR-S-A0009069624-1.pdf?src-supplier=IHS+Markit; ComponentLink1Description: https://datasheet.ciiva.com:443/pdfs/VipMasterIC/IC/BOUR/BOUR-S-A0009069624/BOUR-S-A0009069624-1.pdf?src-supplier=IHS+Markit; ComponentLink2URL: https://datasheet.ciiva.com/11808/0900766b80fcdb72-11808032.pdf?src-supplier=Rs; ComponentLink2Description: https://datasheet.ciiva.com/11808/0900766b80fcdb72-11808032.pdf?src-supplier=Rs; ComponentLink3URL: https://datasheet.ciiva.com/27049/774903-27049975.pdf?src-supplier=Jameco; ComponentLink3Description: https://datasheet.ciiva.com/27049/774903-27049975.pdf?src-supplier=Jameco; ComponentLink4URL: https://datasheet.ciiva.com/22644/1849498-22644171.pdf?src-supplier=Element14; ComponentLink4Description: https://datasheet.ciiva.com/22644/1849498-22644171.pdf?src-supplier=Element14; ComponentLink5URL: https://datasheet.ciiva.com/22693/1902866-22693206.pdf?src-supplier=Element14; ComponentLink5Description: https://datasheet.ciiva.com/22693/1902866-22693206.pdf?src-supplier=Element14; ComponentLink6URL: https://datasheet.ciiva.com/5548/chpreztr-5548911.pdf?src-supplier=Mouser; ComponentLink6Description: https://datasheet.ciiva.com/5548/chpreztr-5548911.pdf?src-supplier=Mouser; ComponentLink7URL: https://datasheet.ciiva.com/16757/70154685-16757483.pdf?src-supplier=Allied+Electronics; ComponentLink7Description: https://datasheet.ciiva.com/16757/70154685-16757483.pdf?src-supplier=Allied+Electronics; ComponentLink8URL: https://datasheet.ciiva.com/3255/chpreztr-3255918.pdf?src-supplier=Avnet; ComponentLink8Description: https://datasheet.ciiva.com/3255/chpreztr-3255918.pdf?src-supplier=Avnet; ComponentLink9URL: https://datasheet.ciiva.com/7001/1902866-7001623.pdf?src-supplier=Newark; ComponentLink9Description: https://datasheet.ciiva.com/7001/1902866-7001623.pdf?src-supplier=Newark
SW2 SW3 = PTS526 Button: PTS526 Series SPST-NO Off-Mom 160 gf Top Actuated J Lead SMT Tactile Switch; Part Class: Other; Manufacturer: ITT C&K; Manufacturer Part Number: PTS526SMG15JSMTR2LFS; CompType: DTSM 32N/SMD; Note: DIPTRONICS; Distributor: RET; Order Code: 52-01-71; Supplier: Mouser; Supplier Part Number: 611-TS526SMG15JSMR2L; RoHS: No; Category: Tactile Switches; Stock: 4081; Pricing: 1=0.14, 10=0.118, 50=0.118, 100=0.112, 1000=0.086, 10000=0.083 (USD); ComponentLink1URL: https://dznh3ojzb2azq.cloudfront.net/products/Tactile/PTS526/documents/datasheet.pdf?src-supplier=Digikey; ComponentLink1Description: https://dznh3ojzb2azq.cloudfront.net/products/Tactile/PTS526/documents/datasheet.pdf?src-supplier=Digikey; ComponentLink2URL: https://datasheet.octopart.com/PTS526SMG15JSMTR2LFS-C%26K-Components-datasheet-138817219.pdf?src-supplier=Future+Electronics; ComponentLink2Description: https://datasheet.octopart.com/PTS526SMG15JSMTR2LFS-C%26K-Components-datasheet-138817219.pdf?src-supplier=Future+Electronics; ComponentLink3URL: https://datasheet.octopart.com/PTS526SMG15JSMTR2LFS-C%26K-Components-datasheet-166147767.pdf?src-supplier=TME; ComponentLink3Description: https://datasheet.octopart.com/PTS526SMG15JSMTR2LFS-C%26K-Components-datasheet-166147767.pdf?src-supplier=TME
U3 = BQ2980: High-side protector for single-cell Li-ion and Li-polymer batteries with 0-V charge disabled 8-X2QFN -40 to 85; Manufacturer: Texas Instruments; Manufacturer Part Number: BQ298217RUGR; Supplier: Mouser; Supplier Part Number: 595-BQ298217RUGR; RoHS: No; Category: Integrated Circuits (ICs); Stock: 2505; Pricing: 1=0.69, 10=0.418, 50=0.418, 100=0.329, 1000=0.297, 10000=0.252 (USD)
U4 = TPS2116: Single-Ended Multiplexer, 1 Func, 2 Channel, PDSO8; Manufacturer: Texas Instruments; Manufacturer Part Number: TPS2116DRLR; Supplier: Mouser; Supplier Part Number: 595-TPS2116DRLR; RoHS: No; Category: Integrated Circuits (ICs); Stock: 36554; Pricing: 1=0.87, 10=0.736, 50=0.736, 100=0.565, 1000=0.394, 10000=0.336 (USD); RoHS Compliant: Yes
U5 = LP5907QMFX-3.3Q1: Fixed Positive LDO Regulator, 3.3V, 0.25V Dropout, PDSO5; Manufacturer_Name: Texas Instruments; Datasheet Link: http://www.ti.com/lit/gpn/lp5907-q1; Height: 1.45mm; Manufacturer_Part_Number: LP5907QMFX-3.3Q1; Mouser Part Number: 595-LP5907QMFX-3.3Q1; Mouser Price/Stock: https://www.mouser.co.uk/ProductDetail/Texas-Instruments/LP5907QMFX-3.3Q1?qs=asCBFxFfL1RsL2VYqGFsBQ%3D%3D; Arrow Part Number: LP5907QMFX-3.3Q1; Arrow Price/Stock: https://www.arrow.com/en/products/lp5907qmfx-3.3q1/texas-instruments; Supplier: Mouser; Supplier Part Number: 595-LP5907QMFX-3.3Q1; Manufacturer: Texas Instruments; Manufacturer Part Number: LP5907QMFX-3.3Q1; RoHS: No; Category: Voltage Regulators - Linear; Stock: 6545; Pricing: 1=0.45, 10=0.274, 50=0.274, 100=0.22, 1000=0.22, 10000=0.218 (USD); ComponentLink1URL: https://datasheet.ciiva.com:443/pdfs/VipMasterIC/IC/TXII/TXII-S-A0007849761/TXII-S-A0007849761-1.pdf?src-supplier=IHS+Markit; ComponentLink1Description: https://datasheet.ciiva.com:443/pdfs/VipMasterIC/IC/TXII/TXII-S-A0007849761/TXII-S-A0007849761-1.pdf?src-supplier=IHS+Markit; ComponentLink2URL: https://datasheet.ciiva.com/48677/lp5907-q1-48677563.pdf?src-supplier=Avnet; ComponentLink2Description: https://datasheet.ciiva.com/48677/lp5907-q1-48677563.pdf?src-supplier=Avnet